# EAGLE design wifi (EAGLE 9.0.0)
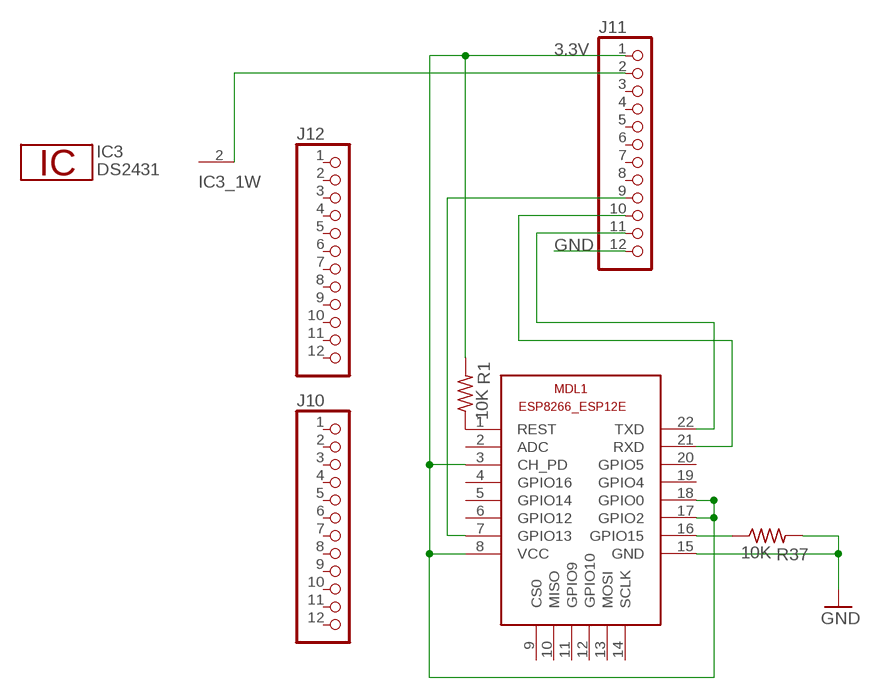
[diagram p0: schematic, sheet 1]

## Parts
IC3  DS2431  [TO92-]
J10  PINHD-1X12  [1X12]
J11  PINHD-1X12  [1X12]
J12  PINHD-1X12  [1X12]
MDL1  ESP8266-12EESP8266-ESP12E  [ESP8266-ESP12E]
R1  10K  R-US_R0805  [R0805]
R37  10K  R-US_R0805  [R0805]

## Nets
3.3V: J11.1 MDL1.3(CH_PD) MDL1.8(VCC) MDL1.17(GPIO2) MDL1.18(GPIO0) R1.2
GND: J11.12 MDL1.15(GND) R37.2
N$1: MDL1.16(GPIO15) R37.1
N$2: J11.9 MDL1.7(GPIO13)
N$3: J11.10 MDL1.21(RXD)
N$4: J11.11 MDL1.22(TXD)
N$5: MDL1.1(REST) R1.1
N$6: IC3.2(1W) J11.2
Unconnected: J10.1 J10.2 J10.3 J10.4 J10.5 J10.6 J10.7 J10.8 J10.9 J10.10 J10.11 J10.12 J11.3 J11.4 J11.5 J11.6 J11.7 J11.8 J12.1 J12.2 J12.3 J12.4 J12.5 J12.6 J12.7 J12.8 J12.9 J12.10 J12.11 J12.12 MDL1.2(ADC) MDL1.4(GPIO16) MDL1.5(GPIO14) MDL1.6(GPIO12) MDL1.9(CS0) MDL1.10(MISO) MDL1.11(GPIO9) MDL1.12(GPIO10) MDL1.13(MOSI) MDL1.14(SCLK) MDL1.19(GPIO4) MDL1.20(GPIO5)

## Power pins joined to a net without a drawn wire
GND: IC3.1(GND)

## Library data of the parts
IC3 = 1wire:DS2431: 1024-Bit EEPROM This chip provides a 4x256 Bit EEPROM, which can be programmed@5V. Write protection and OTP emulation are available, too. Author: Jan Kandziora <jjj@gmx.de>
J10-J12 = pinhead:PINHD-1X12: PIN HEADER
MDL1 = ESP8266-ESP12E:ESP8266-12E: ESP8266-12E with additional I/O and GPIO04/05 corrected The author cannot warrant that this library is free from error or will meet your specific requirements. Created by PuceBaboon.com. Komagane, Nagano, JAPAN
R1 R37 = rcl:R-US_: RESISTOR, American symbol

## Board
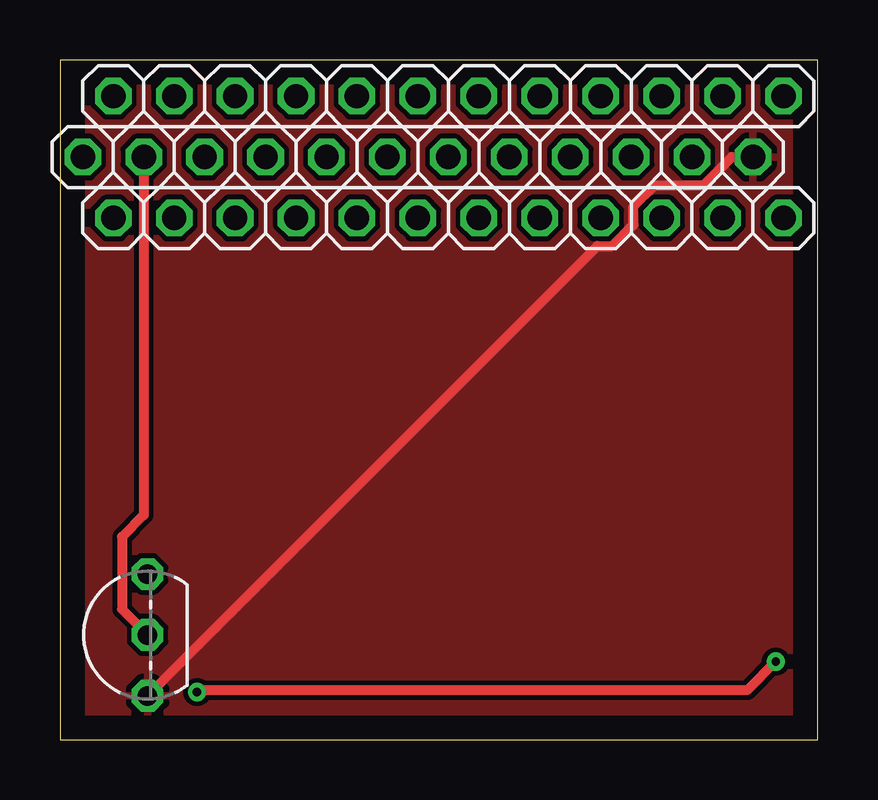
[diagram p1: board, top side]
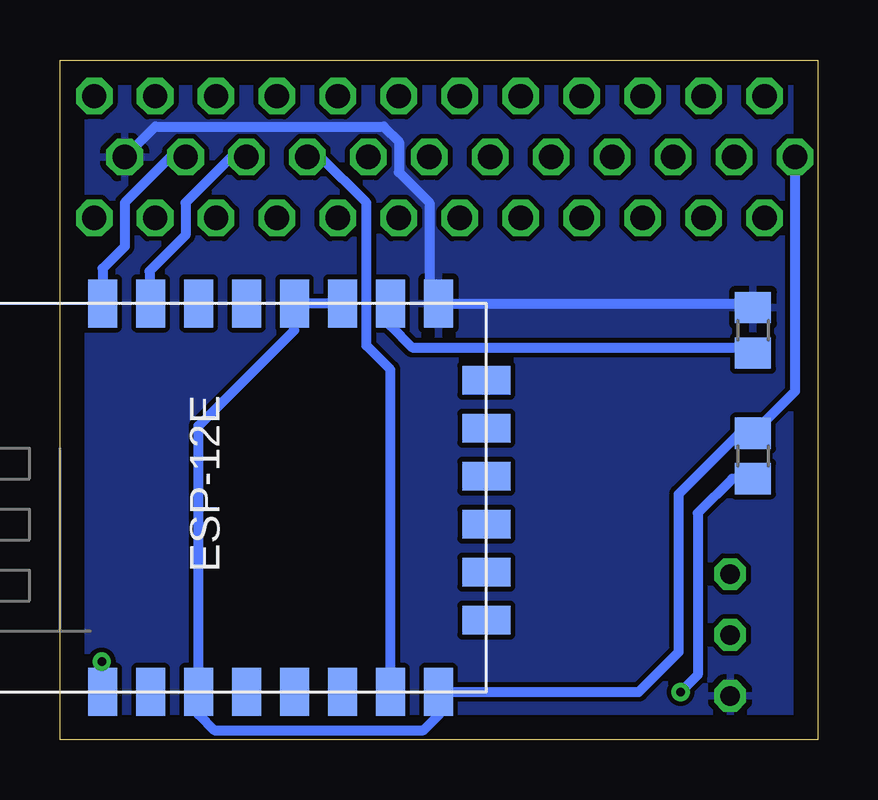
[diagram p2: board, bottom side, seen from below]

Size 31.59 x 28.34 mm. Coordinates in mm from the lower left corner, seen from the top.
Outline: 0,28.33 0,0 31.59,0 31.59,28.34 0,28.34
Copper layers (1*16): Top 0.035mm / dielectric 1.5mm / Bottom 0.035mm
Design rules "default": minimum track width 10mil, minimum drill 24mil, track to track 8mil, track to pad 8mil, pad to pad 8mil, via to via 8mil, smd to smd 8mil, copper to edge 40mil, drill to drill 8mil, minimum pad ring 10mil, minimum via ring 8mil, stop-mask expansion 4mil, vias tented up to drill 0mil, thermal gap 10mil

### Footprints (pad centres in the part's own frame; a part is rotated, then mirrored left to right if it is on the bottom)
TO92- = drill 0.813 octagon: 1 -2.54,0; 2 0,0; 3 2.54,0
1X12 = drill 1.016 octagon: 1 -13.97,0; 2 -11.43,0; 3 -8.89,0; 4 -6.35,0; 5 -3.81,0; 6 -1.27,0; 7 1.27,0; 8 3.81,0; 9 6.35,0; 10 8.89,0; 11 11.43,0; 12 13.97,0
ESP8266-ESP12E = smd 2 x 1.2: 1 0,16; 2 0,14; 3 0,12; 4 0,10; 5 0,8; 6 0,6; 7 0,4; 8 0,2; 15 16.2,2; 16 16.2,4; 17 16.2,6; 18 16.2,8; 19 16.2,10; 20 16.2,12; 21 16.2,14; 22 16.2,16 | smd 1.2 x 2: 9 3,0; 10 5,0; 11 7,0; 12 9,0; 13 11,0; 14 13,0
R0805 = smd 1.3 x 1.5: 1 -0.95,0; 2 0.95,0

### Placement (x,y rotation side)
IC3  3.65,4.37 90 top
J10  16.19,26.83 0 top
J11  14.92,24.29 0 top
J12  16.19,21.75 0 top
MDL1  13.81,1.98 90 bottom
R1  2.7,11.83 90 bottom
R37  2.7,17.07 90 bottom

### Tracks (layer width: path | path; a pad name or v marks a point on that pad's centre or on a via)
3.3V
  Bottom 0.406: 15.57,2.22 MDL1.8 | MDL1.17 MDL1.18 21.83,18.17 21.83,17.07 25.81,13.08 MDL1.3 25.81,1.05 25.16,0.4 16.43,0.4 15.8,1.03 15.8,1.97 MDL1.8 | J11.1 0.95,14.52 2.58,12.9 | R1.2 2.58,12.9 | 2.58,12.9 3.14,12.9 5.79,10.24 5.79,3.65 7.46,1.98 MDL1.8
GND
  Top 0.406: IC3.1 22.41,20.58 23.03,20.58 23.91,21.47 23.91,22.23 24.8,23.12 26.84,23.12 28,24.29 J11.12
  Bottom 0.406: J11.12 27.62,25.56 18.1,25.56 17.46,24.92 17.46,23.65 16.19,22.38 16.19,19.13 15.81,18.75 MDL1.15 2.87,18.18 R37.2
  pour Bottom: 0.32,28.02 31.35,28.02 31.35,0.32 0.32,0.32
  pour Top: 0.32,28.02 31.35,28.02 31.35,0.32 0.32,0.32
N$1
  Bottom 0.406: MDL1.16 17.81,17.26 16.91,16.35 2.93,16.35 2.85,16.27 2.78,16.19 R37.1
N$2
  Bottom 0.406: MDL1.7 17.81,15.43 18.81,16.43 18.81,22.38 20.72,24.29 J11.9
N$3
  Bottom 0.406: MDL1.21 27.86,18.23 27.86,18.41 27.86,18.89 27.86,19.53 26.35,21.03 26.35,22.38 24.45,24.29 J11.10
N$4
  Bottom 0.406: J11.11 26.99,24.29 28.89,22.38 28.89,20.56 29.81,19.64 MDL1.22
N$5  (via drill 0.35)
  Top 0.406: v29.84,3.25 28.65,2.06 5.79,2.06 v5.71,1.98
  Bottom 0.406: v29.84,3.25 29.84,2.02 MDL1.1 | R1.1 3.57,10.88 5,9.45 5,2.7 v5.71,1.98
N$6
  Top 0.406: J11.2 3.49,9.37 2.58,8.46 2.58,5.43 IC3.2